# Altium schematic sheet comunicador_alarmar_v1.SchDoc
size A2; DrawnBy: Mariano Mondani
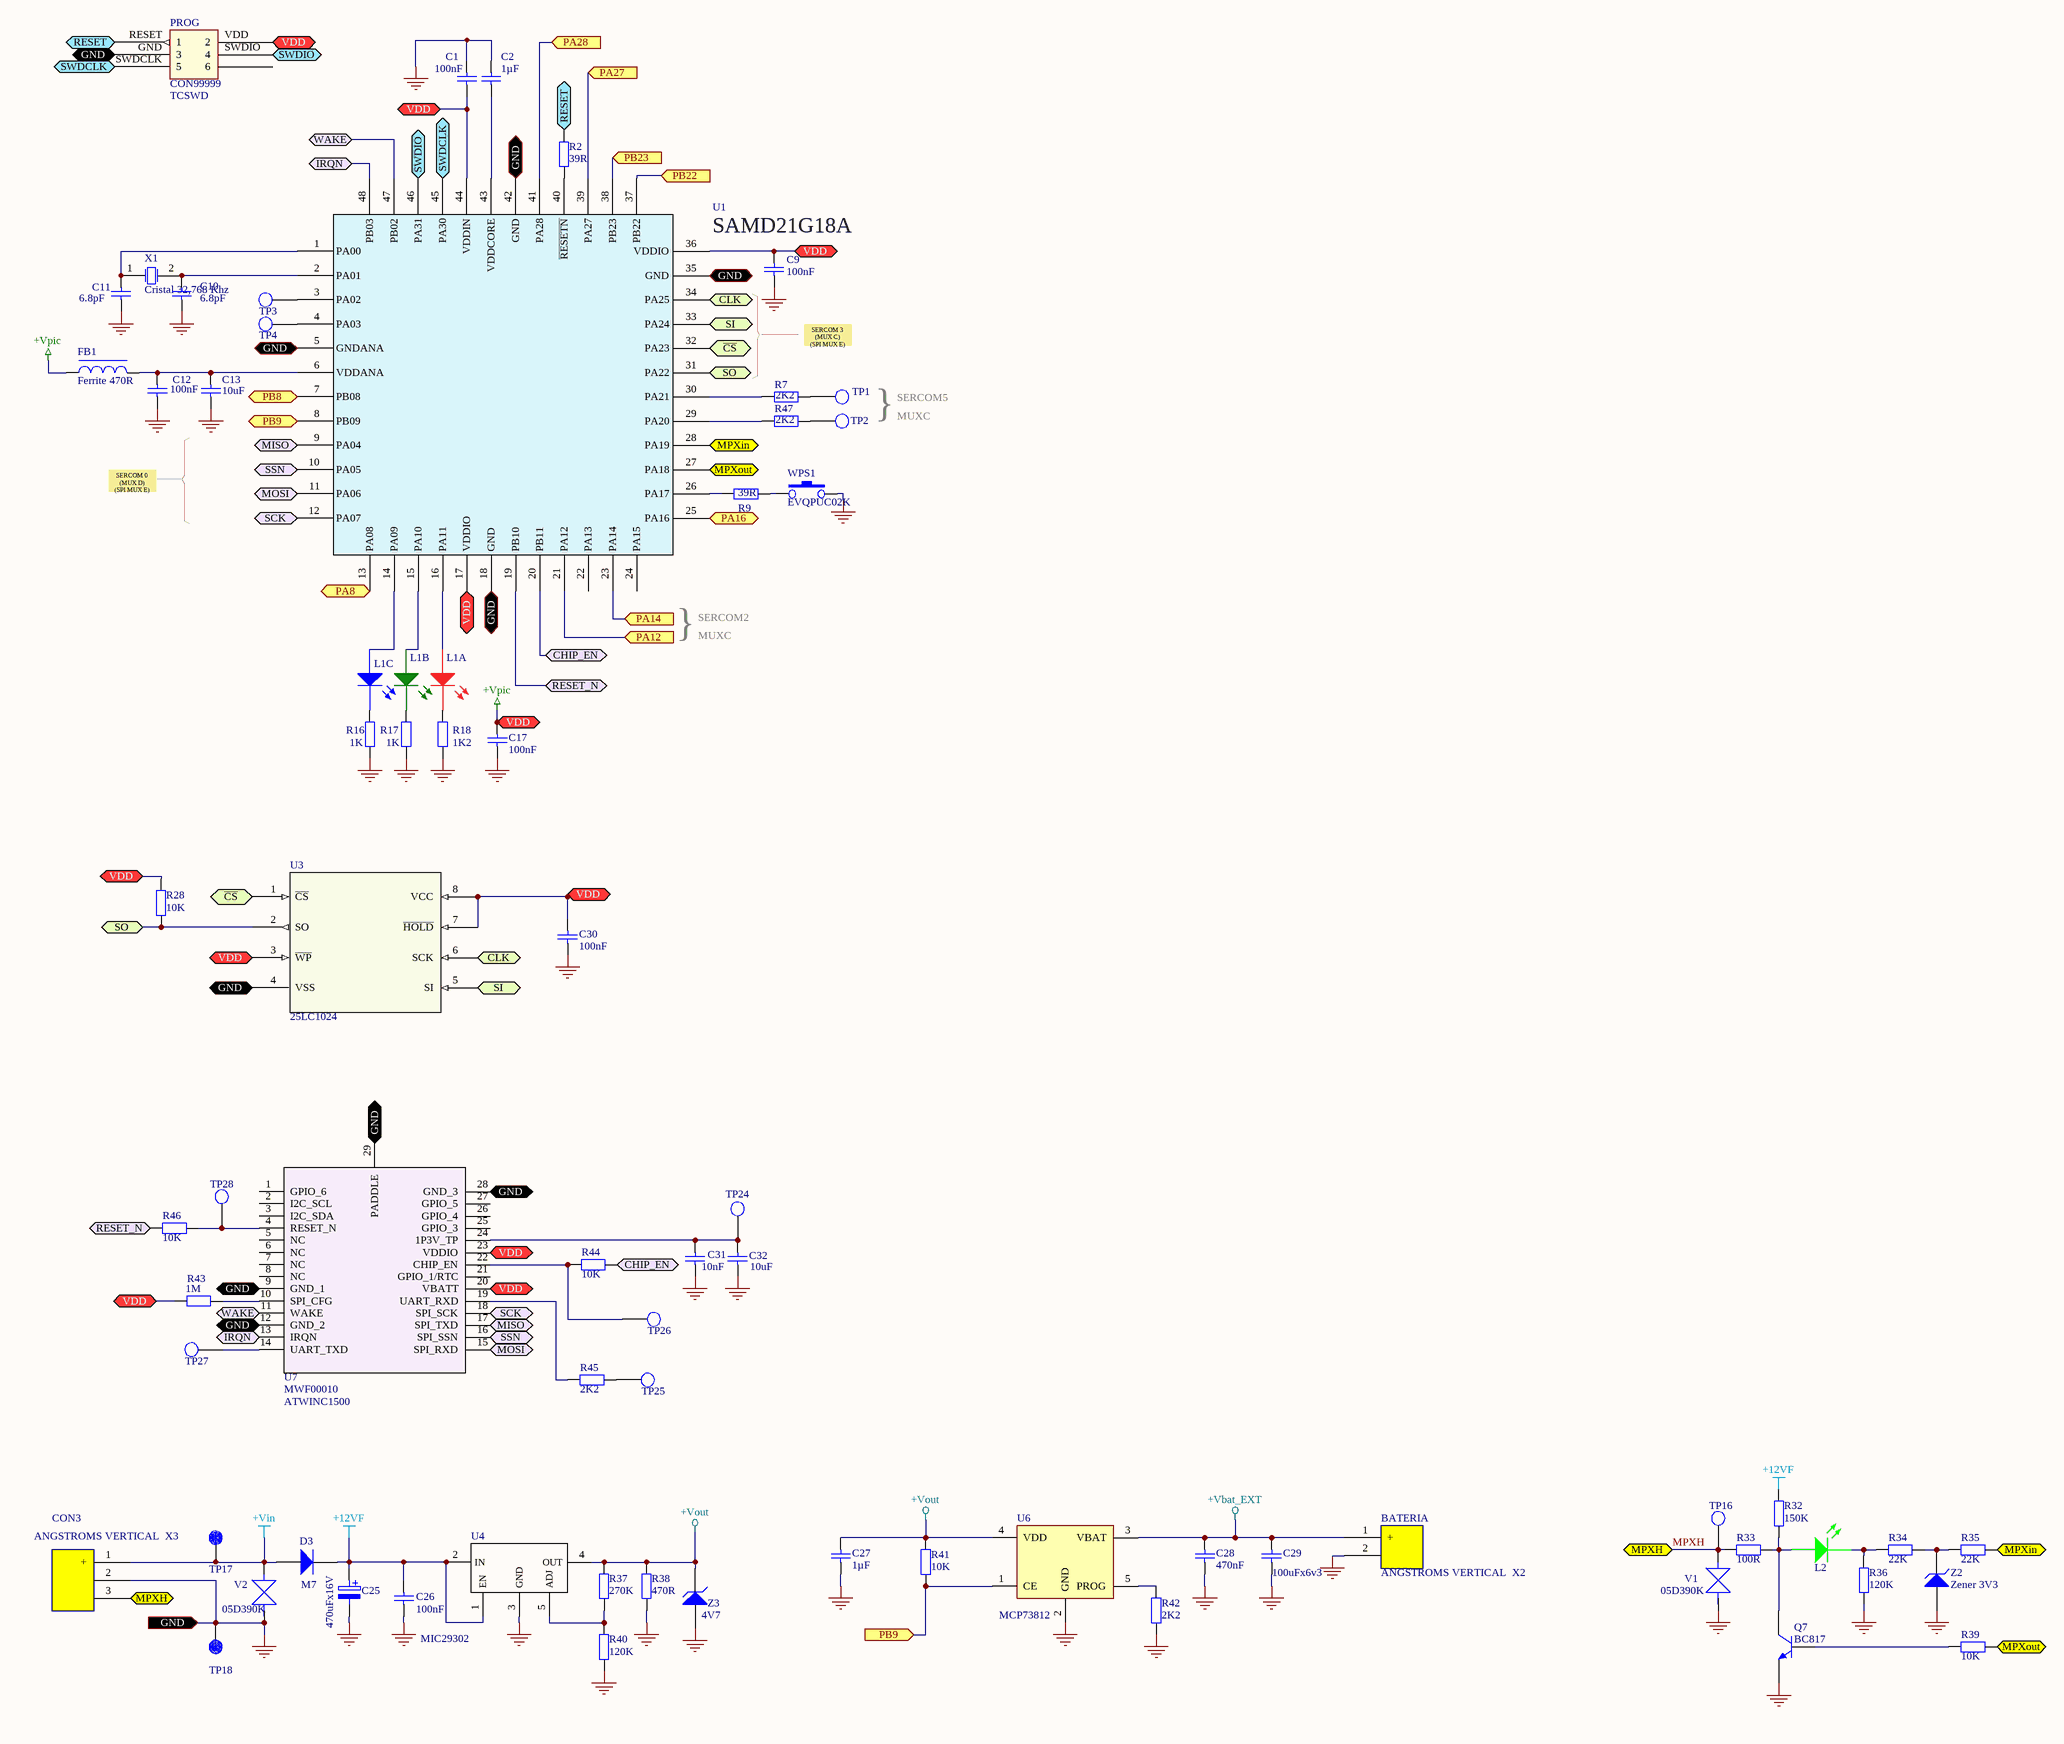
[diagram p0: comunicador_alarmar_v1.SchDoc]

## Parts
BATERIA  value ANGSTROMS VERTICAL  X2  [CON.2V.SMD.ANGSTROMS]  (hidden comment: CON00590)
C1  value 100nF  [C.0805-rflow]  (hidden comment: CAX00450)
C2  value 1µF  [C.0805-rflow]  (hidden comment: CAX00500)
C9  value 100nF  [C.0805-rflow]  (hidden comment: CAX00450)
C10  value 6.8pF  [C.0805-rflow]  (hidden comment: CAX00110)
C11  value 6.8pF  [C.0805-rflow]  (hidden comment: CAX00110)
C12  value 100nF  [C.0805-rflow]  (hidden comment: CAX00450)
C13  value 10uF  [C.212]  (hidden comment: CAX00520)
C17  value 100nF  [C.0805-rflow]  (hidden comment: CAX00450)
C25  value 470uFx16V  [CAP.CASE-E]  (hidden comment: CES00020)
C26  value 100nF  [C.0805-rflow]  (hidden comment: CAX00450)
C27  value 1µF  [C.0805]  (hidden comment: CAX00500)
C28  value 470nF  [C.0805]  (hidden comment: CAX00460)
C29  value 100uFx6v3  [C.1206-rflow]  (hidden comment: CES00011)
C30  value 100nF  [C.0805-rflow]  (hidden comment: CAX00450)
C31  value 10nF  [C.0805-rflow]  (hidden comment: CAX00370)
C32  value 10uF  [C.212]  (hidden comment: CAX00520)
CON3  value ANGSTROMS VERTICAL  X3  [CON.3V.SMD.ANGSTROMS]  (hidden comment: CON00600)
D3  value M7  [SMA.RFLOW]  (hidden comment: DIS00030)
FB1  value Ferrite 470R  [BOB.0603]  (hidden comment: FER00010)
L1  LES00150  [LED5050.RGB.FORYARD]  (value not drawn)  (parts A,B,C of 3)
L2  LES00090  [L.0805G]  (value not drawn)
PROG  value TCSWD  [TC_SWD]  (hidden comment: CON99999)
Q7  value BC817  [SOT23-3]  (hidden comment: TRS00020)
R2  value 39R  [R.0805-rflow]  (hidden comment: RSX00065)
R7  value 2K2  [R.0805-rflow]  (hidden comment: RSX00200)
R9  value 39R  [R.0805-rflow]  (hidden comment: RSX00065)
R16  value 1K  [R.0805-rflow]  (hidden comment: RSX00170)
R17  value 1K  [R.0805-rflow]  (hidden comment: RSX00170)
R18  value 1K2  [R.0805-rflow]  (hidden comment: RSX00180)
R28  value 10K  [R.0805-rflow]  (hidden comment: RSX00280)
R32  value 150K  [R.0805-rflow]  (hidden comment: RSX00390)
R33  value 100R  [R.0805-rflow]  (hidden comment: RSX00090)
R34  value 22K  [R.0805-rflow]  (hidden comment: RSX00310)
R35  value 22K  [R.0805-rflow]  (hidden comment: RSX00310)
R36  value 120K  [R.0805-rflow]  (hidden comment: RSX00380)
R37  value 270K  [R.0805-rflow]  (hidden comment: RSX00420)
R38  value 470R  [R.0805-rflow]  (hidden comment: RSX00140)
R39  value 10K  [R.0805-rflow]  (hidden comment: RSX00280)
R40  value 120K  [R.0805-rflow]  (hidden comment: RSX00380)
R41  value 10K  [R.0805-rflow]  (hidden comment: RSX00280)
R42  value 2K2  [R.0805-rflow]  (hidden comment: RSX00200)
R43  value 1M  [R.0805-rflow]  (hidden comment: RSX00490)
R44  value 10K  [R.0805-rflow]  (hidden comment: RSX00280)
R45  value 2K2  [R.0805-rflow]  (hidden comment: RSX00200)
R46  value 10K  [R.0805-rflow]  (hidden comment: RSX00280)
R47  value 2K2  [R.0805-rflow]  (hidden comment: RSX00200)
TP1  Test Point  [TestPoint_2mm]  (value not drawn)
TP2  Test Point  [TestPoint_2mm]  (value not drawn)
TP3  Test Point  [TestPoint_2mm]  (value not drawn)
TP4  Test Point  [TestPoint_2mm]  (value not drawn)
TP16  Test Point  [TestPoint_2mm]  (value not drawn)
TP17  Test Point  [TestPoint_2mm]  (value not drawn)
TP18  Test Point  [TestPoint_2mm]  (value not drawn)
TP24  Test Point  [TestPoint_2mm]  (value not drawn)
TP25  Test Point  [TestPoint_2mm]  (value not drawn)
TP26  Test Point  [TestPoint_2mm]  (value not drawn)
TP27  Test Point  [TestPoint_2mm]  (value not drawn)
TP28  Test Point  [TestPoint_2mm]  (value not drawn)
U1  value SAMD21G18A  [TQFP_48]  (hidden comment: INS00250)
U3  value 25LC1024  [SOIJ-8]  (hidden comment: INS00260)
U4  value MIC29302  [TO263-5]  (hidden comment: INS00240)
U6  value MCP73812  [SOT23-5]  (hidden comment: INS00180)
U7  MWF00010  value ATWINC1500  [ATWINC1500]
V1  value 05D390K  [R.1206-rflow]  (hidden comment: VAR00080)
V2  value 05D390K  [R.1206-rflow]  (hidden comment: VAR00080)
WPS1  value EVQPUC02K  [PUL.EVQPUC]  (hidden comment: TOU00120)
X1  value Cristal 32,768 Khz  [XTAL_SMD_32768]  (hidden comment: CRS00040)
Z2  value Zener 3V3  [SOT23-3]  (hidden comment: ZES00005)
Z3  value 4V7  [SOT23-3]  (hidden comment: ZES00010)

## Ports
CHIP_EN, CLK, GND (bidir), GND (in), IRQN, MISO, MOSI, MPXH, MPXH (in), MPXin, MPXout, PA8 (in), PA12 (in), PA14 (in), PA16 (in), PA27 (in), PA28 (in), PB8 (in), PB9 (in), PB22 (in), PB23 (in), RESET, RESET_N, SCK, SI, SO, SSN, SWDCLK, SWDIO, VDD (bidir), WAKE, ~{CS}

## Nets
+12VF: C25.1 C26.2 D3.2(K) R32.2 U4.1(EN) U4.2(IN)
+Vbat_EXT: BATERIA.1(+) C28.2 C29.2 U6.3(VBAT)
+Vin: CON3.1(+) D3.1(A) TP17.0 V2.2
+Vout: C27.2 R37.2 R38.2 R41.2 U4.4(OUT) U6.4(VDD) Z3.3(K)
+Vpic: C1.2 C9.2 C17.2 C30.2 FB1.1 PROG.VDD(2) R28.2 R43.1 U1.17(VDDIO) U1.36(VDDIO) U1.44(VDDIN) U3.3(~{WP}) U3.7(~{HOLD}) U3.8(VCC) U7.20(VBATT) U7.23(VDDIO) ; port VDD
GND: BATERIA.2 C1.1 C2.1 C9.1 C10.1 C11.1 C12.1 C13.1 C17.1 C25.2 C26.1 C27.1 C28.1 C29.1 C30.1 C31.1 C32.1 CON3.0 CON3.2 PROG.GND(3) Q7.2(E) R16.1 R17.1 R18.1 R36.1 R38.1 R40.1 R42.1 TP18.0 U1.5(GNDANA) U1.18(GND) U1.35(GND) U1.42(GND) U3.4(VSS) U4.3(GND) U6.2(GND) U7.9(GND_1) U7.12(GND_2) U7.28(GND_3) U7.29(PADDLE) V1.1 V2.1 WPS1.2 Z2.1(A) Z3.1(A) ; port GND
~{CS}: U1.32(PA23) U3.1(~{CS}) ; port ~{CS}
CHIP_EN: R44.2 U1.20(PB11) ; port CHIP_EN
CLK: U1.34(PA25) U3.6(SCK) ; port CLK
IRQN: U1.48(PB03) U7.13(IRQN) ; port IRQN
MISO: U1.9(PA04) U7.17(SPI_TXD) ; port MISO
MOSI: U1.11(PA06) U7.15(SPI_RXD) ; port MOSI
MPXH: CON3.3 R33.1 TP16.0 V1.2 ; port MPXH
MPXin: R35.2 U1.28(PA19) ; port MPXin
MPXout: R39.2 U1.27(PA18) ; port MPXout
PA8: U1.13(PA08) ; port PA8
PA12: U1.21(PA12) ; port PA12
PA14: U1.23(PA14) ; port PA14
PA16: U1.25(PA16) ; port PA16
PA27: U1.39(PA27) ; port PA27
PA28: U1.41(PA28) ; port PA28
PB8: U1.7(PB08) ; port PB8
PB9: R41.1 U1.8(PB09) U6.1(CE) ; port PB9
PB22: U1.37(PB22) ; port PB22
PB23: U1.38(PB23) ; port PB23
RESET: PROG.RESET(1) R2.1 ; port RESET
RESET_N: R46.1 U1.19(PB10) ; port RESET_N
SCK: U1.12(PA07) U7.18(SPI_SCK) ; port SCK
SI: U1.33(PA24) U3.5(SI) ; port SI
SO: R28.1 U1.31(PA22) U3.2(SO) ; port SO
SSN: U1.10(PA05) U7.16(SPI_SSN) ; port SSN
SWDCLK: PROG.SWDCLK(5) U1.45(PA30) ; port SWDCLK
SWDIO: PROG.SWDIO(4) U1.46(PA31) ; port SWDIO
WAKE: U1.47(PB02) U7.11(WAKE) ; port WAKE
NetC2_2: C2.2 U1.43(VDDCORE)
NetC10_2: C10.2 U1.2(PA01) X1.2(OSC2)
NetC11_2: C11.2 U1.1(PA00) X1.1(OSC1)
NetC12_2: C12.2 C13.2 FB1.2 U1.6(VDDANA)
NetC31_2: C31.2 C32.2 TP24.0 U7.24(1P3V_TP)
NetL1_AB: L1.AB U1.14(PA09)
NetL1_AG: L1.AG U1.15(PA10)
NetL1_AR: L1.AR U1.16(PA11)
NetL1_KB: L1.KB R16.2
NetL1_KG: L1.KG R17.2
NetL1_KR: L1.KR R18.2
NetL2_A: L2.A Q7.3(C) R32.1 R33.2
NetL2_K: L2.K R34.1 R36.2
NetQ7_1: Q7.1(B) R39.1
NetR2_2: R2.2 U1.40(~{RESETN})
NetR7_1: R7.1 U1.30(PA21)
NetR7_2: R7.2 TP1.0
NetR9_1: R9.1 WPS1.1
NetR9_2: R9.2 U1.26(PA17)
NetR34_2: R34.2 R35.1 Z2.3(K)
NetR37_1: R37.1 R40.2 U4.5(ADJ)
NetR42_2: R42.2 U6.5(PROG)
NetR43_2: R43.2 U7.10(SPI_CFG)
NetR44_1: R44.1 TP26.0 U7.22(CHIP_EN)
NetR45_1: R45.1 U7.19(UART_RXD)
NetR45_2: R45.2 TP25.0
NetR46_2: R46.2 TP28.0 U7.4(RESET_N)
NetR47_1: R47.1 U1.29(PA20)
NetR47_2: R47.2 TP2.0
NetTP3_0: TP3.0 U1.3(PA02)
NetTP4_0: TP4.0 U1.4(PA03)
NetTP27_0: TP27.0 U7.14(UART_TXD)

Not connected (* = marked no-connect by the designer): PROG ?1(6); U1 22(PA13) 24(PA15); U7 1(GPIO_6) 2(I2C_SCL) 3(I2C_SDA) 5(NC) 6(NC) 7(NC) 8(NC) 21(GPIO_1/RTC) 25(GPIO_3) 26(GPIO_4) 27(GPIO_5)

## Notes on the sheet
- SERCOM 3
  (MUX C)
  (SPI MUX E)
- }
- SERCOM5
- MUXC
- SERCOM 0
  (MUX D)
  (SPI MUX E)
- SERCOM2
- (near U1) }

## Library data of the parts
BATERIA = CON.2.SMD.VER: Conector Angstroms 2V; Part Number: A2001WV-S-2P; Manufacturer: ANGSTROMS CORP.; MFG: CON00590
C1 C9 C12 C17 C26 C30 = CAP.100n: Capacitor SMD; MFG: CAX00450
C2 C27 = CAP.1u: Capacitor SMD; MFG: CAX00500
C10 C11 = CAP.6.8pF: Capacitor SMD; MFG: CAX00110
C13 C32 = CAP.10uF: Capacitor 212; Part Number: EMK212BJ106MG-T; Supplier: Taiyo; MFG: CAX00520
C25 = CAP.470µ-A: Capacitor Aluminio SMD; Part Number: ELV471M16RE; Supplier: Hitano; MFG: CES00020
C28 = CAP.470n: Capacitor SMD; MFG: CAX00460
C29 = CAP.100µ-S: Capacitor 1206 SMD; Part Number: JMK316BJ107ML-T; Manufacturer: Taiyo Yuden; Supplier: Digi-Key; MFG: CES00011
C31 = CAP.10n: Capacitor SMD; MFG: CAX00370
CON3 = CON.3.SMD.VER: Conector Angstroms 3V; Part Number: A2001WV-S-3P; Manufacturer: ANGSTROMS CORP.; MFG: CON00600
D3 = DIO.M7: Diodo DSMA; Manufacturer: Shenzhen Luguang Electronic Technology; Part Number: M7; Supplier: Classic Component; MFG: DIS00030
FB1 = FER.470R: Ferrite 470; Part Number: BLM18PG471SN1D; Manufacturer: Murata Electronics; MFG: FER00010
L1 = LED.RGB.5050 FORYARD: Led RGB 5050; Part Number: FYLS-5050 RGBC; Value: Led RGB 5050 FY; Manufacturer: FORYARD; Datasheet: http://www.foryard.com/x-en/p-download/d-Part/u-f/m-1/n-f_FYLS-5050RGBC/y-394; MFG: LES00150
L2 = L.0805G: Led 0805; Part Number: TY-0805 YG1; Value: Led 0805 Verde; MFG: LES00090
PROG = TCSWD: Conector Grabación; MFG: CON99999
Q7 = Q.817: NPN-TBJ; Part Number: BC817-25LT1G; Manufacturer: ON-SEMI; Supplier: Arrow Electronics; MFG: TRS00020
R2 R9 = RES.39R: MFG: RSX00065
R7 R45 R47 = RES.2K2: MFG: RSX00200
R16 R17 = RES.1K: MFG: RSX00170
R18 = RES.1K2: MFG: RSX00180
R28 R39 R44 = RES.10K: MFG: RSX00280
R32 = RES.150K: MFG: RSX00390
R33 = RES.100R: MFG: RSX00090
R34 R35 = RES.22K: MFG: RSX00310
R36 R40 = RES.120K: MFG: RSX00380
R37 = RES.270K: MFG: RSX00420
R38 = RES.470R: MFG: RSX00140
R41 R46 = RES.10k: MFG: RSX00280
R42 = RES.2k2: MFG: RSX00200
R43 = RES.1M: MFG: RSX00490
U1 = SAM D21G18A: SMART ARM-Based Microcontroller; Part Number: ATSAMD21G18A; Manufacturer: Atmel; MFG: INS00250
U3 = 25LC1024_SOIJ: SPI EEPROM; Manufacturer: Microchip; Part Number: 25LC1024; MFG: INS00260
U4 = MIC29302: Regulador Seteable 3A; MFG: INS00240
U6 = MCP73812: Regulador; Part Number: MCP73812T-420I/OT; Manufacturer: Microchip; Supplier: Classic Component; Part Number 2: MCP73812T-420I/OT; Manufacturer 2: Microchip; Supplier 2: Ibars Electronics; MFG: INS00180
U7 = ATWINC1500-MR210PB: Módulo WIFI; Manufacturer: Microchip; MFG: MWF00010; Part Number: ATWINC1500-MR210PB
V1 V2 = VAR.05SMD: Varistor SMD 39V; MFG: VAR00080
WPS1 = PUL.EVQ: Tecla 90° SMD; Manufacturer: Panasonic Electronic Components; Part Number: EVQPUC02K; MFG: TOU00120
X1 = X.32,768K: Cristal 32,768 Khz; Part Number: ST3215SB32768C0HPWBB; Manufacturer: Kyocera International Inc.; MFG: CRS00040
Z2 = Z.3V3: Zenner SMD; Part Number: BZX84-C3V3; Manufacturer: NXP SEMICONDUCTOR; Supplier: Classic Component; MFG: ZES00005
Z3 = Z.4V7: Zenner SMD; Part Number: BZX84-C4V7,215; Manufacturer: NXP SEMICONDUCTOR; Supplier: Classic Component; Supplier 2: Arrow Electronics; MFG: ZES00010